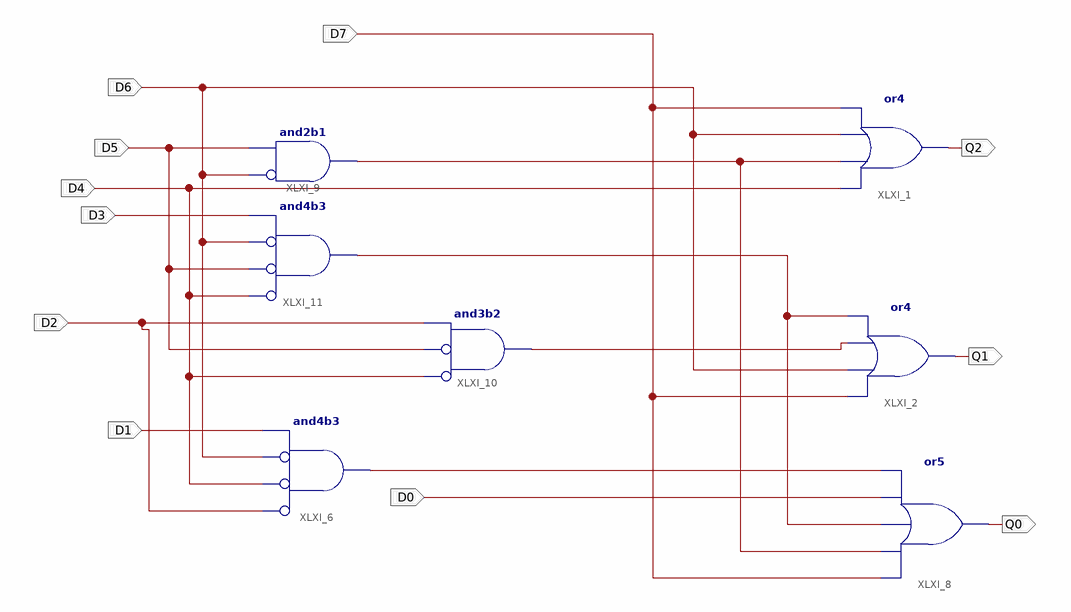
[diagram p0: schematic sheet 1]
// Xilinx ISE schematic scheme.sch (virtex5) as structural Verilog: 7 symbols, 11 ports
module scheme (
  input  D7,
  input  D4,
  input  D3,
  input  D1,
  input  D6,
  input  D2,
  input  D0,
  input  D5,
  output Q2,
  output Q1,
  output Q0
);

  or XLXI_1 (Q2, D4, D5, D6, D7);
  or XLXI_2 (Q1, D7, D6, D2, D3);
  and XLXI_6 (D1, ~D2, ~D4, ~D6, D1);  // and4b3
  or XLXI_8 (Q0, D7, D5, D3, D0, D1);
  and XLXI_10 (D2, ~D4, ~D5, D2);  // and3b2
  and XLXI_11 (D3, ~D4, ~D5, ~D6, D3);  // and4b3
  and XLXI_9 (D5, ~D6, D5);  // and2b1
endmodule
